# EAGLE design Schema_pcb (EAGLE 7.1.0)
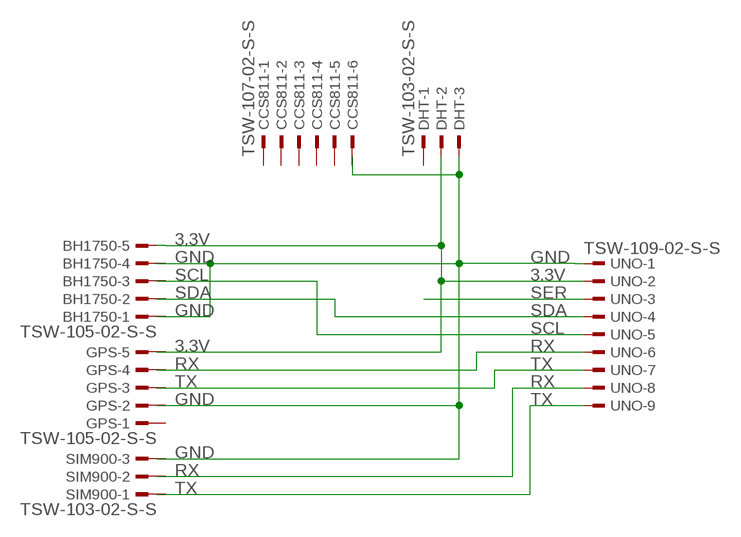
[diagram p0: schematic, sheet 1]

## Parts
BH1750  TSW-105-02-S-S  [TSW-105-02-S-S]
CCS811  TSW-107-02-S-S  [TSW-107-02-S-S]
DHT  TSW-103-02-S-S  [TSW-103-02-S-S]
GPS  TSW-105-02-S-S  [TSW-105-02-S-S]
SIM900  TSW-103-02-S-S  [TSW-103-02-S-S]
UNO  TSW-109-02-S-S  [TSW-109-02-S-S]

## Nets
3.3V: BH1750.5 UNO.2
GND: BH1750.1 BH1750.4 UNO.1
RX: UNO.6 UNO.8
SCL: BH1750.3 UNO.5
SDA: BH1750.2 UNO.4
SER: UNO.3
TX: UNO.9
Unconnected: CCS811.1 CCS811.2 CCS811.3 CCS811.4 CCS811.5 CCS811.6 CCS811.7 DHT.1 DHT.2 DHT.3 GPS.1 GPS.2 GPS.3 GPS.4 GPS.5 SIM900.1 SIM900.2 SIM900.3 UNO.7

## Library data of the parts
BH1750 GPS = con-samtec:TSW-105-02-S-S: THROUGH-HOLE .025" SQ POST HEADER Source: Samtec TSW.pdf; OC_FARNELL: unknown; OC_NEWARK: unknown
CCS811 = con-samtec:TSW-107-02-S-S: THROUGH-HOLE .025" SQ POST HEADER Source: Samtec TSW.pdf; OC_FARNELL: unknown; OC_NEWARK: unknown
DHT SIM900 = con-samtec:TSW-103-02-S-S: THROUGH-HOLE .025" SQ POST HEADER Source: Samtec TSW.pdf; OC_FARNELL: unknown; OC_NEWARK: unknown
UNO = con-samtec:TSW-109-02-S-S: THROUGH-HOLE .025" SQ POST HEADER Source: Samtec TSW.pdf; OC_FARNELL: unknown; OC_NEWARK: unknown

## Board
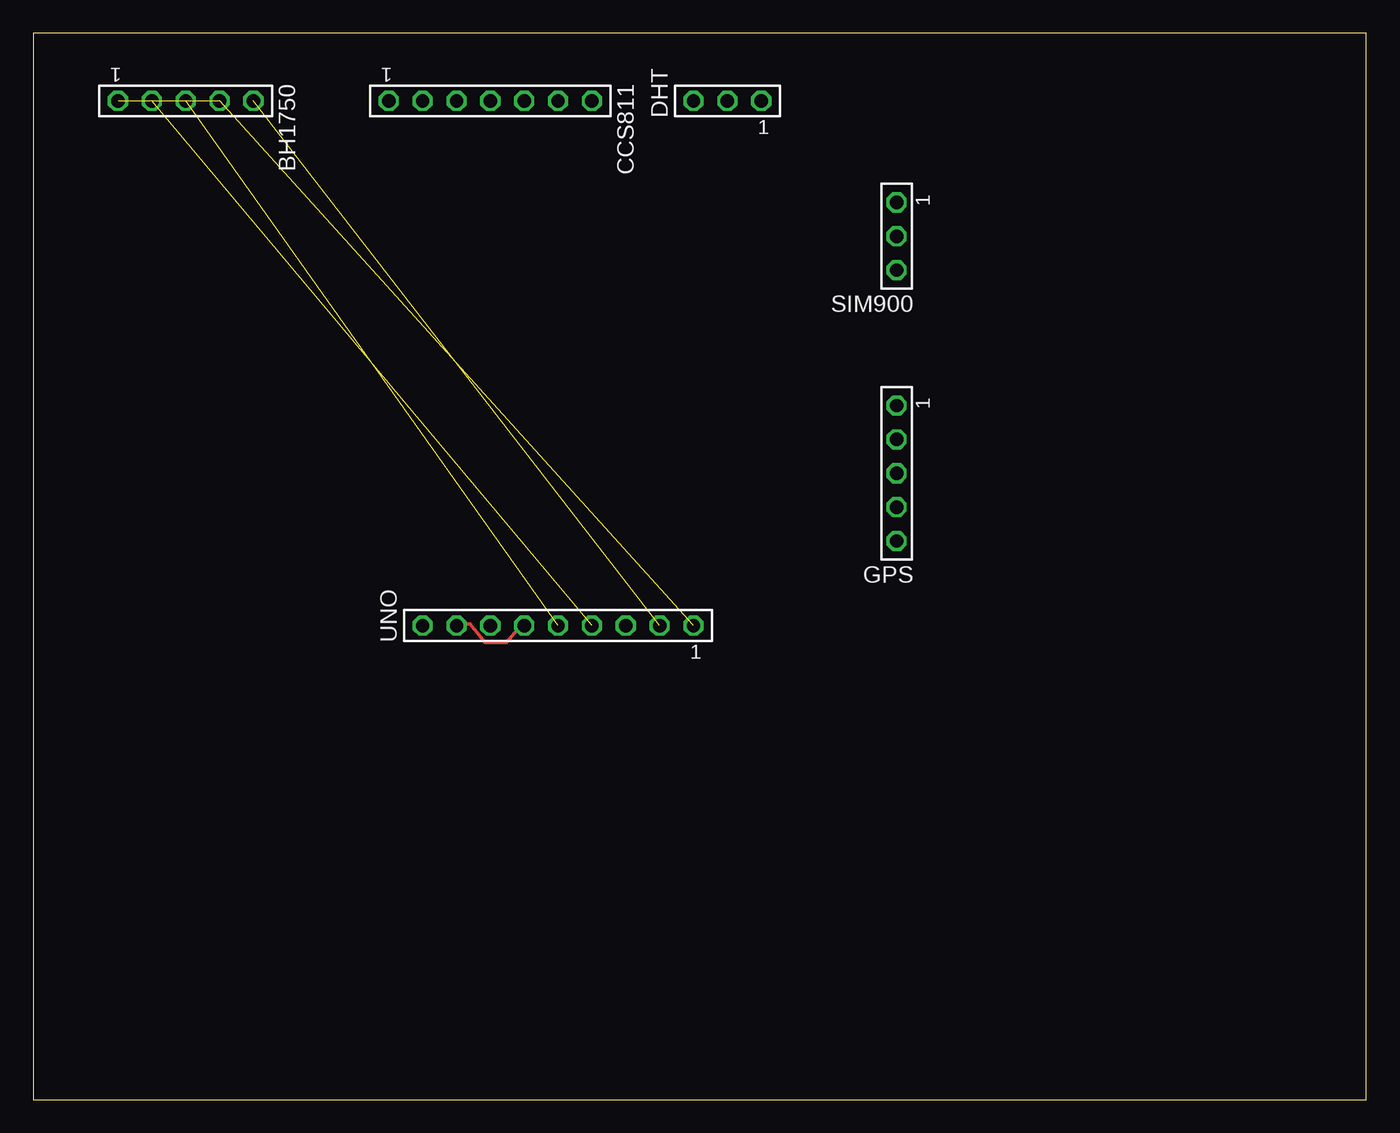
[diagram p1: board, top side]

Size 100 x 80 mm. Coordinates in mm from the lower left corner, seen from the top.
Outline: 0,0 100,0 100,80 0,80 0,0
Copper layers (1*16): Top 0.035mm / dielectric 1.5mm / Bottom 0.035mm
Design rules "default": minimum track width 10mil, minimum drill 24mil, track to track 8mil, track to pad 8mil, pad to pad 8mil, via to via 8mil, smd to smd 8mil, copper to edge 40mil, drill to drill 8mil, minimum pad ring 10mil, minimum via ring 8mil, stop-mask expansion 4mil, vias tented up to drill 0mil, thermal gap 10mil

### Footprints (pad centres in the part's own frame; a part is rotated, then mirrored left to right if it is on the bottom)
TSW-105-02-S-S = drill 1 pad 1.5 octagon: 1 5.08,0; 2 2.54,0; 3 0,0; 4 -2.54,0; 5 -5.08,0
TSW-107-02-S-S = drill 1 pad 1.5 octagon: 1 7.62,0; 2 5.08,0; 3 2.54,0; 4 0,0; 5 -2.54,0; 6 -5.08,0; 7 -7.62,0
TSW-103-02-S-S = drill 1 pad 1.5 octagon: 1 2.54,0; 2 0,0; 3 -2.54,0
TSW-109-02-S-S = drill 1 pad 1.5 octagon: 1 10.16,0; 2 7.62,0; 3 5.08,0; 4 2.54,0; 5 0,0; 6 -2.54,0; 7 -5.08,0; 8 -7.62,0; 9 -10.16,0

### Placement (x,y rotation side)
BH1750  11.43,74.93 180 top
CCS811  34.29,74.93 180 top
DHT  52.07,74.93 0 top
GPS  64.77,46.99 90 top
SIM900  64.77,64.77 90 top
UNO  39.37,35.56 0 top

### Tracks (layer width: path | path; a pad name or v marks a point on that pad's centre or on a via)
3.3V  (1 unrouted)
GND  (2 unrouted)
RX
  Top 0.254: UNO.8 31.85,35.69 32.77,35.69 33.91,34.29 35.51,34.29 36.65,35.69 UNO.6
SCL  (1 unrouted)
SDA  (1 unrouted)